# EAGLE design haasoscope_pro_preinput_board (EAGLE 9.6.2)
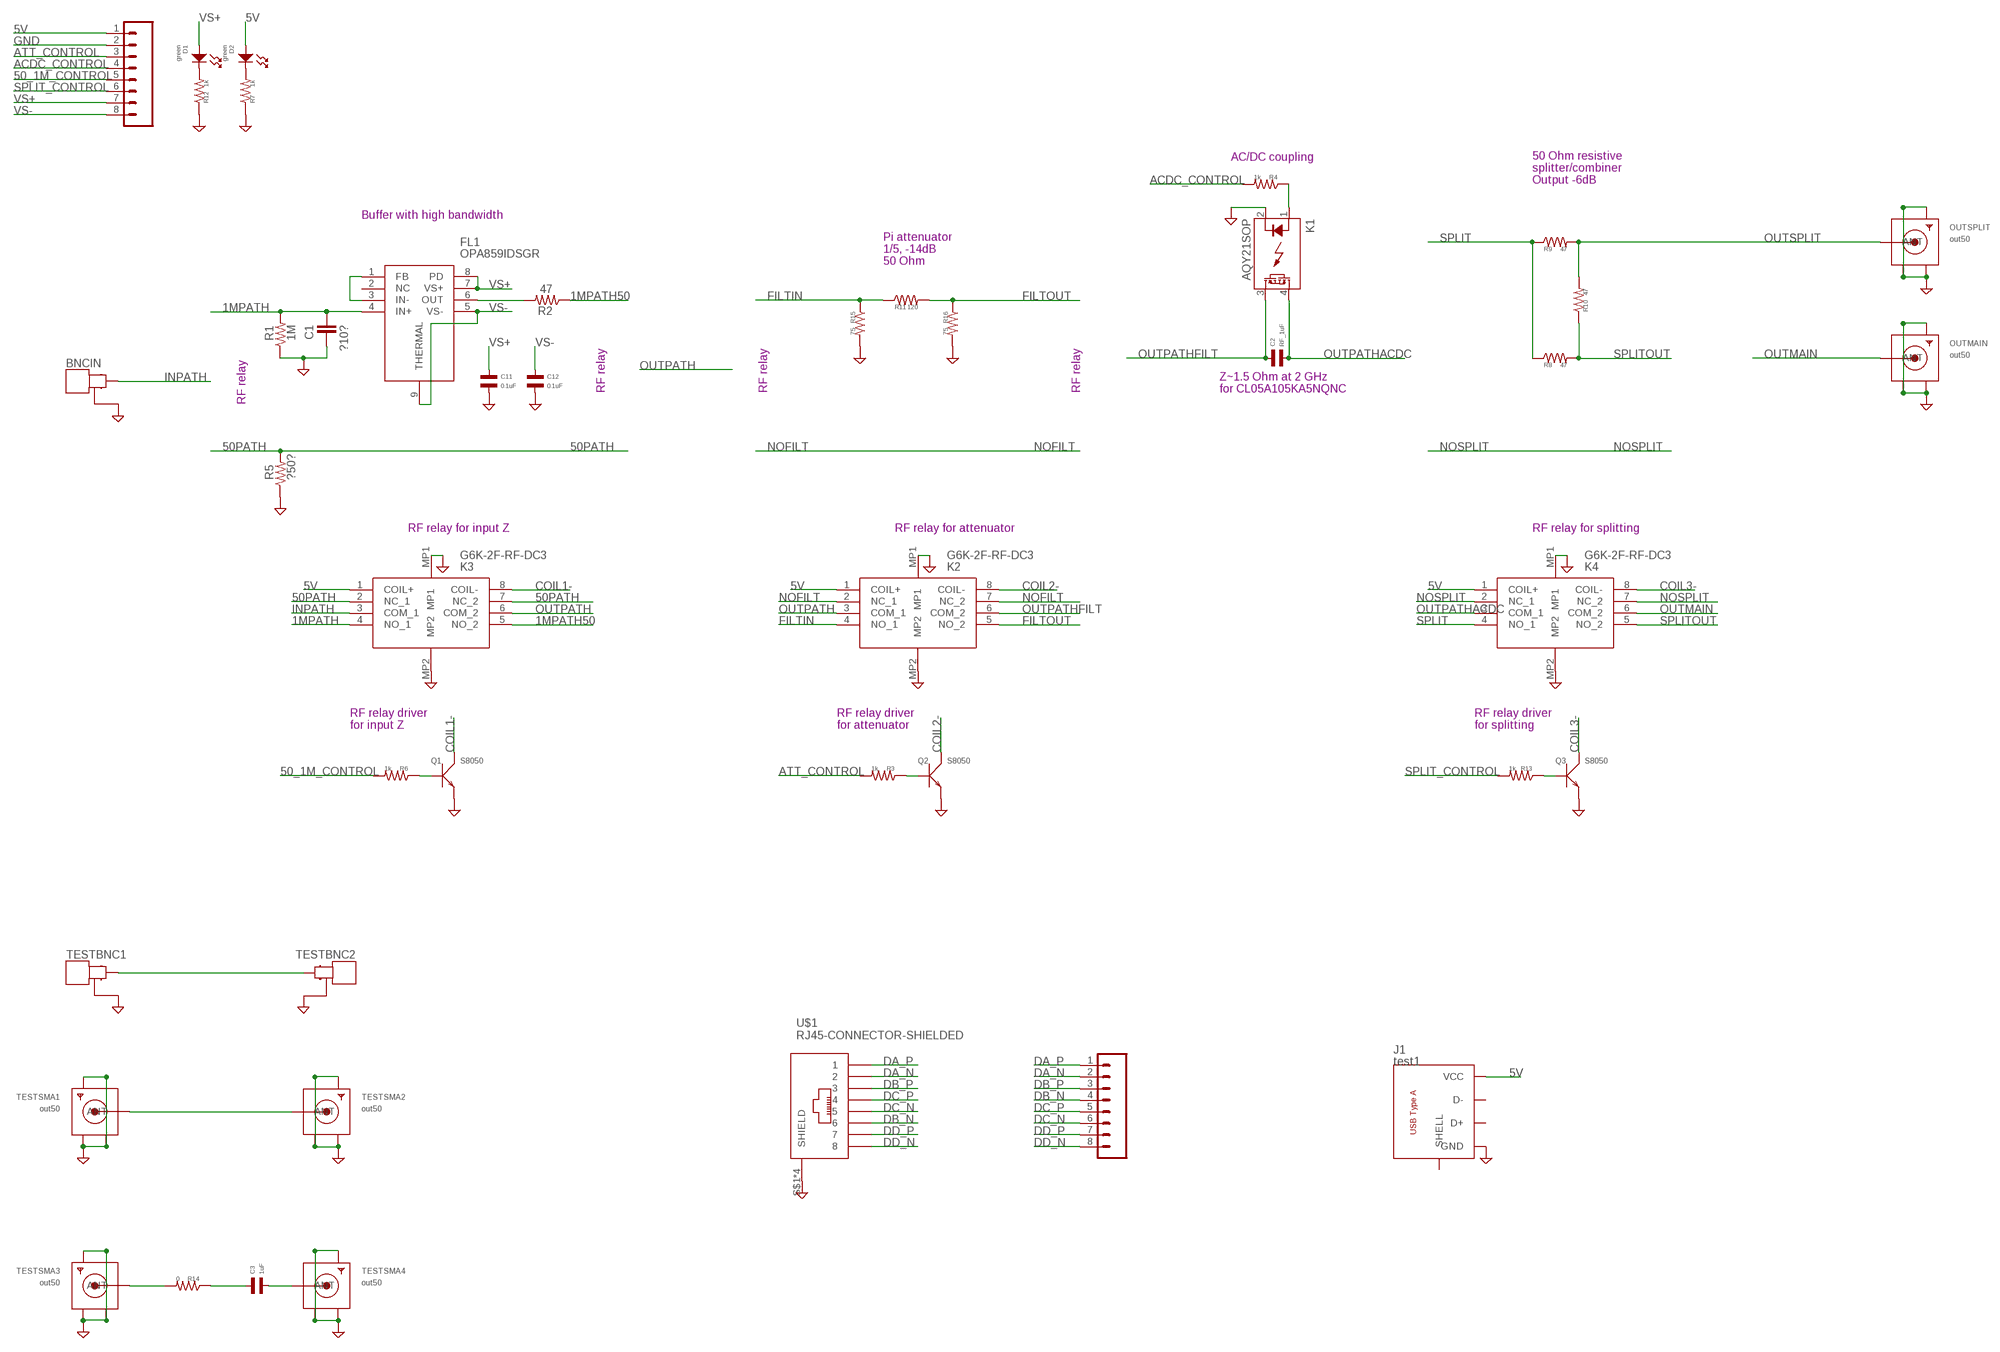
[diagram p0: schematic, sheet 1]

## Parts
BNCIN  MOLEX_BNC_73100-0105  [MOLEX-BNC-73100-0105]
C1  ?10?  C-EUC0805  [C0805]
C2  RF_1uF  CAPACITOR_NP_0402  [C0402]
C3  1uF  CAPACITOR_NP_0402  [C0402]
C11  0.1uF  CAPACITOR_NP_0402  [C0402]
C12  0.1uF  CAPACITOR_NP_0402  [C0402]
D1  green  LED_SINGLE-0603  [LED0603]
D2  green  LED_SINGLE-0603  [LED0603]
FL1  OPA859IDSGR  [SON50P200X200X80-9N]
J1  test1  USB-TYPE-ATHT-RA  [USB-2.0-A-THT-RA-TE_AMP-292303-1]
J2  8pin  CONN_08"  [1X08]
J4  8pin  CONN_08"  [1X08]
K1  AQY21SOP  [SOP04]
K2  G6K-2F-RF-DC3  [G6K2FRFDC3]
K3  G6K-2F-RF-DC3  [G6K2FRFDC3]
K4  G6K-2F-RF-DC3  [G6K2FRFDC3]
OUTMAIN  out50  SMACONNECTOR_EDGE  [SMA_EDGELAUNCH]
OUTSPLIT  out50  SMACONNECTOR_EDGE  [SMA_EDGELAUNCH]
Q1  S8050  SMD-TRANSISTORS-NPN-25V-500MW-S8050(SOT-23)  [SOT-23]
Q2  S8050  SMD-TRANSISTORS-NPN-25V-500MW-S8050(SOT-23)  [SOT-23]
Q3  S8050  SMD-TRANSISTORS-NPN-25V-500MW-S8050(SOT-23)  [SOT-23]
R1  1M  R-US_R0805  [R0805]
R2  47  R-US_R0805  [R0805]
R3  1k  RESISTOR_0402  [R0402]
R4  1k  RESISTOR_0402  [R0402]
R5  ?50?  R-US_R0805  [R0805]
R6  1k  RESISTOR_0402  [R0402]
R7  1k  RESISTOR_0402  [R0402]
R8  47  RESISTOR_0402  [R0402]
R9  47  RESISTOR_0402  [R0402]
R10  47  RESISTOR_0402  [R0402]
R11  120  RESISTOR_0402  [R0402]
R12  1k  RESISTOR_0402  [R0402]
R13  1k  RESISTOR_0402  [R0402]
R14  0  RESISTOR_0402  [R0402]
R15  75  RESISTOR_0402  [R0402]
R16  75  RESISTOR_0402  [R0402]
TESTBNC1  MOLEX_BNC_73100-0105  [MOLEX-BNC-73100-0105]
TESTBNC2  MOLEX_BNC_73100-0105  [MOLEX-BNC-73100-0105]
TESTSMA1  out50  SMACONNECTOR_EDGE  [SMA_EDGELAUNCH]
TESTSMA2  out50  SMACONNECTOR_EDGE  [SMA_EDGELAUNCH]
TESTSMA3  out50  SMACONNECTOR_EDGE  [SMA_EDGELAUNCH]
TESTSMA4  out50  SMACONNECTOR_EDGE  [SMA_EDGELAUNCH]
U$1  RJ45-CONNECTOR-SHIELDED  [RJ45_THT_RA_AMPH-FRJAE448]

## Nets
1MPATH: C1.2 FL1.4(IN+) K3.4(NO_1) R1.2
1MPATH50: K3.5(NO_2) R2.1
5V: D2.ANODE J1.P$1(VCC) J4.1 K2.1(COIL+) K3.1(COIL+) K4.1(COIL+)
50_1M_CONTROL: J4.5 R6.P$2
50PATH: K3.2(NC_1) K3.7(NC_2) R5.2
ACDC_CONTROL: J4.4 R4.P$2
ATT_CONTROL: J4.3 R3.P$2
COIL1-: K3.8(COIL-) Q1.3(C)
COIL2-: K2.8(COIL-) Q2.3(C)
COIL3-: K4.8(COIL-) Q3.3(C)
DA_N: J2.2 U$1.P$2
DA_P: J2.1 U$1.P$1
DB_N: J2.4 U$1.P$6
DB_P: J2.3 U$1.P$3
DC_N: J2.6 U$1.P$5
DC_P: J2.5 U$1.P$4
DD_N: J2.8 U$1.P$8
DD_P: J2.7 U$1.P$7
FILTIN: K2.4(NO_1) R11.P$1 R15.P$1
FILTOUT: K2.5(NO_2) R11.P$2 R16.P$1
GND: BNCIN.GND1(GND) BNCIN.GND2(GND) C1.1 C11.P$2 C12.P$2 J1.P$4(GND) J4.2 K1.2(K) K2.MP1 K2.MP2 K3.MP1 K3.MP2 K4.MP1 K4.MP2 OUTMAIN.GND@1(GND4) OUTMAIN.GND@2(GND3) OUTMAIN.GND@3(GND2) OUTMAIN.GND@4(GND1) OUTSPLIT.GND@1(GND4) OUTSPLIT.GND@2(GND3) OUTSPLIT.GND@3(GND2) OUTSPLIT.GND@4(GND1) Q1.2(E) Q2.2(E) Q3.2(E) R1.1 R5.1 R7.P$1 R12.P$1 R15.P$2 R16.P$2 TESTBNC1.GND1(GND) TESTBNC1.GND2(GND) TESTBNC2.GND1(GND) TESTBNC2.GND2(GND) TESTSMA1.GND@1(GND4) TESTSMA1.GND@2(GND3) TESTSMA1.GND@3(GND2) TESTSMA1.GND@4(GND1) TESTSMA2.GND@1(GND4) TESTSMA2.GND@2(GND3) TESTSMA2.GND@3(GND2) TESTSMA2.GND@4(GND1) TESTSMA3.GND@1(GND4) TESTSMA3.GND@2(GND3) TESTSMA3.GND@3(GND2) TESTSMA3.GND@4(GND1) TESTSMA4.GND@1(GND4) TESTSMA4.GND@2(GND3) TESTSMA4.GND@3(GND2) TESTSMA4.GND@4(GND1) U$1.S$1(SHIELD) U$1.S$2(SHIELD) U$1.S$3(SHIELD) U$1.S$4(SHIELD)
INPATH: BNCIN.SIGNAL K3.3(COM_1)
N$1: D1.CATHODE R12.P$2
N$2: Q2.1(B) R3.P$1
N$3: Q3.1(B) R13.P$1
N$4: FL1.6(OUT) R2.2
N$5: FL1.1(FB) FL1.3(IN-)
N$6: Q1.1(B) R6.P$1
N$7: D2.CATHODE R7.P$2
N$8: TESTBNC1.SIGNAL TESTBNC2.SIGNAL
N$9: TESTSMA1.P(ANT) TESTSMA2.P(ANT)
N$10: R14.P$2 TESTSMA3.P(ANT)
N$11: K1.1(A) R4.P$1
N$12: C3.P$1 R14.P$1
N$13: C3.P$2 TESTSMA4.P(ANT)
NOFILT: K2.2(NC_1) K2.7(NC_2)
NOSPLIT: K4.2(NC_1) K4.7(NC_2)
OUTMAIN: K4.6(COM_2) OUTMAIN.P(ANT)
OUTPATH: K2.3(COM_1) K3.6(COM_2)
OUTPATHACDC: C2.P$2 K1.4(DS1) K4.3(COM_1)
OUTPATHFILT: C2.P$1 K1.3(DS2) K2.6(COM_2)
OUTSPLIT: OUTSPLIT.P(ANT) R9.P$2 R10.P$2
SPLIT: K4.4(NO_1) R8.P$1 R9.P$1
SPLIT_CONTROL: J4.6 R13.P$2
SPLITOUT: K4.5(NO_2) R8.P$2 R10.P$1
VS+: C11.P$1 D1.ANODE FL1.7(VS+) FL1.8(PD) J4.7
VS-: C12.P$1 FL1.5(VS-) FL1.9(THERMAL) J4.8
Unconnected: FL1.2(NC) J1.P$2(D-) J1.P$3(D+) J1.S$1(SHELL) J1.S$2(SHELL)

## Notes on the sheet
- AC/DC coupling
- 50 Ohm resistive 
  splitter/combiner
  Output -6dB
- Buffer with high bandwidth
- Pi attenuator
  1/5, -14dB
  50 Ohm
- RF relay | RF relay | RF relay
- Z~1.5 Ohm at 2 GHz
  for CL05A105KA5NQNC
- RF relay
- RF relay for input Z | RF relay for attenuator | RF relay for splitting
- RF relay driver
  for input Z
- RF relay driver
  for attenuator
- RF relay driver
  for splitting

## Library data of the parts
BNCIN TESTBNC1 TESTBNC2 = connector:MOLEX_BNC_73100-0105: CONN BNC JACK R/A 50 OHM PCB; DIGIKEY: WM5524-ND; MPN: 73100-0105
C1 = resistor:C-EU: CAPACITOR, European symbol
C2 = MF_Passives:CAPACITOR_NP: Library: MF_Passives Description: Device for Non-Polarized Capacitors. Manufacture part number (MPN) can be added via Attributes. Check https://factory.macrofab.com/parts for the house parts list.; LCSC: C52923; POPULATE: 1
C3 C11 C12 = MF_Passives:CAPACITOR_NP: Library: MF_Passives Description: Device for Non-Polarized Capacitors. Manufacture part number (MPN) can be added via Attributes. Check https://factory.macrofab.com/parts for the house parts list.; POPULATE: 1
D1 D2 = MF_LEDs:LED_SINGLE: Library: MF_LEDs Description: Device for Single LED Packages. Manufacture part number (MFG#) can be added via Attributes.; HOUSEPART: NO; LCSC: C2286; POPULATE: 1
FL1 = OPA859IDSGR:OPA859IDSGR: 1.8 GHz Unity-Gain Bandwidth, 3.3 nV/Hz, FET Input Amplifier Source: Datasheet <http://www.ti.com/lit/gpn/opa859>; DESCRIPTION: 1.8 GHz Unity-Gain Bandwidth, 3.3 nV/Hz, FET Input Amplifier; HEIGHT: 0.8mm; MANUFACTURER_NAME: Texas Instruments; MANUFACTURER_PART_NUMBER: OPA859IDSGR; MOUSER_PART_NUMBER: 595-OPA859IDSGR; MOUSER_PRICE-STOCK: https://www.mouser.co.uk/ProductDetail/Texas-Instruments/OPA859IDSGR?qs=qSfuJ%252Bfl%2Fd54IFp3Wwx4ug%3D%3D
J1 = FlashPCB_Connectors:USB-TYPE-A
J2 J4 = SparkFun-Connectors:CONN_08: Multi connection point. Often used as Generic Header-pin footprint for 0.1 inch spaced/style header connections On any of the 0.1 inch spaced packages, you can populate with these: Break Away Headers - Straight <https://www.sparkfun.com/products/116> (PRT-00116) Break Away Male Headers - Right Angle <https://www.sparkfun.com/products/553> (PRT-00553) Female Headers <https://www.sparkfun.com/products/115> (PRT-00115) Break Away Headers - Machine Pin <https://www.sparkfun.com/products/117> (PRT-00117) Break Away Female Headers - Swiss Machine Pin <https://www.sparkfun.com/products/743> (PRT-00743) Arduino Stackable Header - 8 Pin <https://www.sparkfun.com/products/9279> (PRT-09279) For SCREWTERMINALS and SPRING TERMINALS visit here: Screw Terimnals on SparkFun.com <https://www.sparkfun.com/search/results?term=Screw+Terminals> (5mm/3.5mm/2.54mm spacing) This device is also useful as a general connection point to wire up your design to another part of your project. Our various solder wires solder well into these plated through hole pads. Hook-Up Wire - Assortment (Stranded, 22 AWG) <https://www.sparkfun.com/products/11375> (PRT-11375) Hook-Up Wire - Assortment (Solid Core, 22 AWG) <https://www.sparkfun.com/products/11367> (PRT-11367) View the entire wire category on our website here <https://www.sparkfun.com/categories/141> Special notes: Molex polarized connector foot print use with SKU : PRT-08231 with associated crimp pins and housings. 1MM SMD Version SKU: PRT-10208 NOTES ON THE VARIANTS LOCK and LOCK_LONGPADS... This footprint was designed to help hold the alignment of a through-hole component (i.e. 6-pin header) while soldering it into place. You may notice that each hole has been shifted either up or down by 0.005 of an inch from it's more standard position (which is a perfectly straight line). This slight alteration caused the pins (the squares in the middle) to touch the edges of the holes. Because they are alternating, it causes a "brace" to hold the component in place. 0.005 has proven to be the perfect amount of "off-center" position when using our standard breakaway headers. Although looks a little odd when you look at the bare footprint, once you have a header in there, the alteration is very hard to notice. Also,if you push a header all the way into place, it is covered up entirely on the bottom side.; PROD_ID: CONN-08438
K1 = relay:AQY*: PhotoMOS Relay NAiS Source: http://www.panasonic-electric-works.com/catalogues/downloads/photomos/ds_x615_en_aqz10_20.pdf; LCSC: C7435105; MPN: AQY210S; OC_FARNELL: unknown; OC_NEWARK: unknown
K2-K4 = G6K-2F-RF-DC3:G6K-2F-RF-DC3: High Frequency / RF Relays 1GHz Std Grd NoLatch DPDT 3VDC 100mW Source: Datasheet <https://componentsearchengine.com/Datasheets/1/G6K-2F-RF-DC3.pdf>; DESCRIPTION: High Frequency / RF Relays 1GHz Std Grd NoLatch DPDT 3VDC 100mW; HEIGHT: 5.7mm; LCSC: C397195; MANUFACTURER_NAME: Omron Electronics; MANUFACTURER_PART_NUMBER: G6K-2F-RF-DC3; MOUSER_PART_NUMBER: 653-G6K-2F-RF-DC3; MOUSER_PRICE-STOCK: https://www.mouser.co.uk/ProductDetail/Omron-Electronics/G6K-2F-RF-DC3?qs=Pjd0UV7BHP8BL6Nr%252BzW3GA%3D%3D
OUTMAIN OUTSPLIT TESTSMA1-TESTSMA4 = adafruit:SMACONNECTOR: SMA Connector 90° DIP SMA Connector, 50 Ohm (4UConnector: 07259)
Q1-Q3 = Seeed-Transistor:SMD-TRANSISTORS-NPN-25V-500MW-S8050(SOT-23): 305010017; LCSC: C7420370; MPN: S8050
R1 R2 R5 = resistor:R-US_: RESISTOR, American symbol
R3 R4 R6-R16 = MF_Passives:RESISTOR: Library: MF_Passives Description: Device for Resistors. Manufacture part number (MPN), Voltage, Tolerance, and Wattage Rating can be added via Attributes. Check https://factory.macrofab.com/parts for the house parts list.; POPULATE: 1
U$1 = FlashPCB_Connectors:RJ45-CONNECTOR-SHIELDED

## Net classes
0 default: width 0.203 mm
1 power: width 0.152 mm

## Board
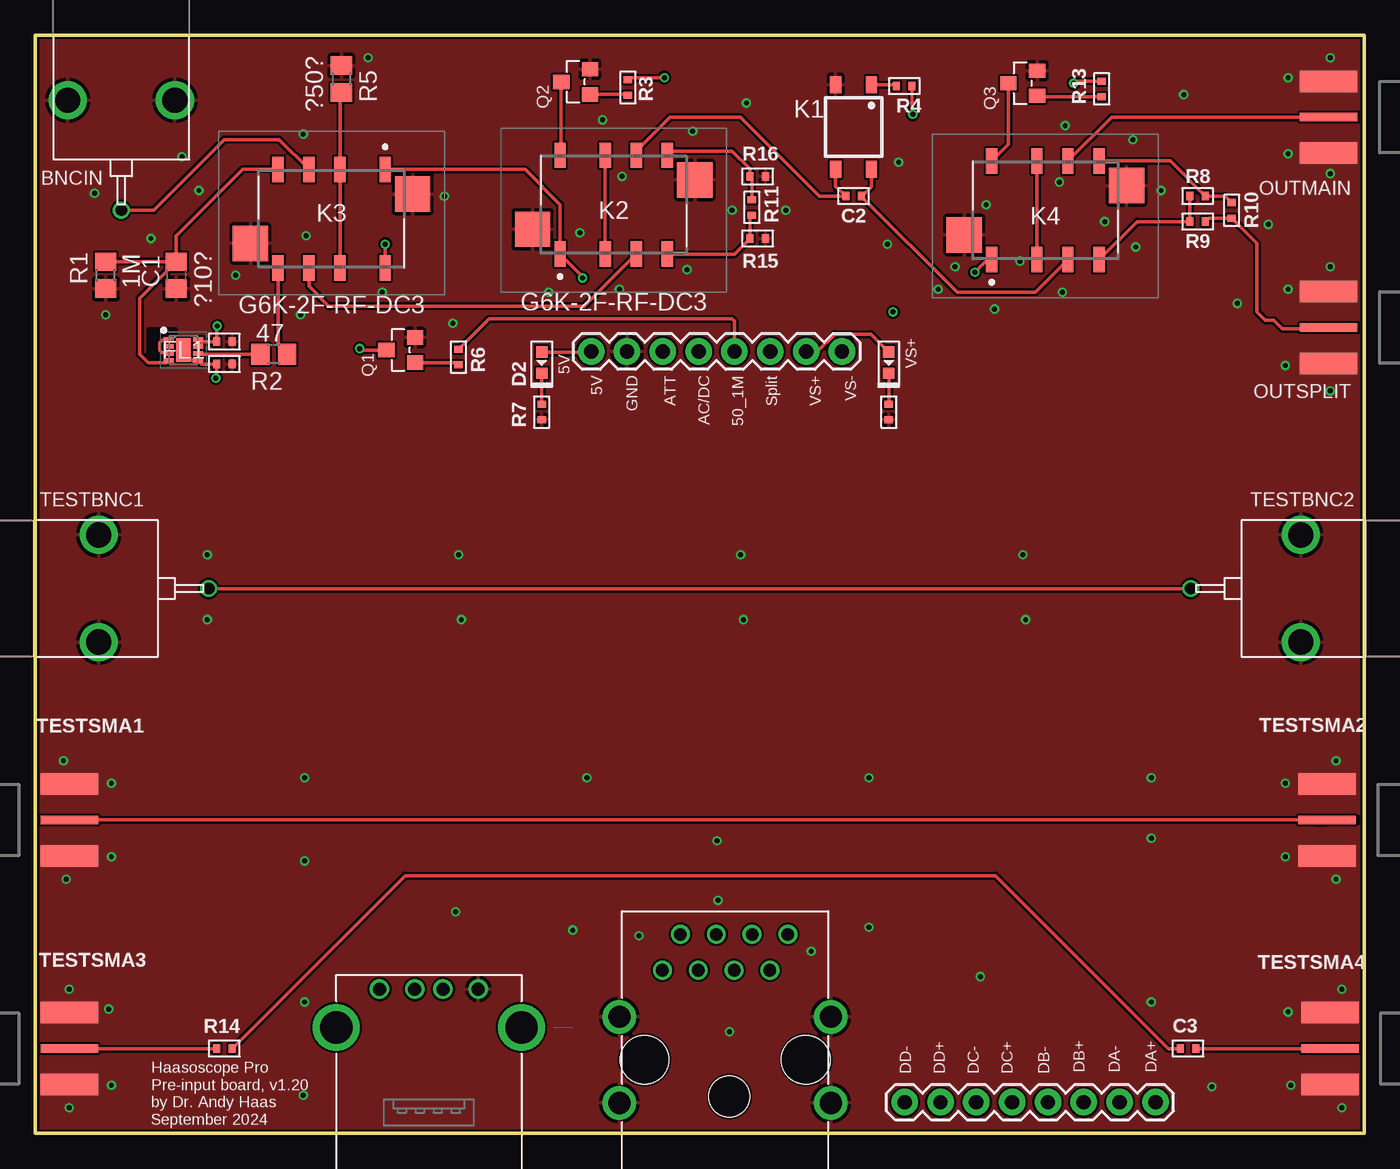
[diagram p1: board, top side]
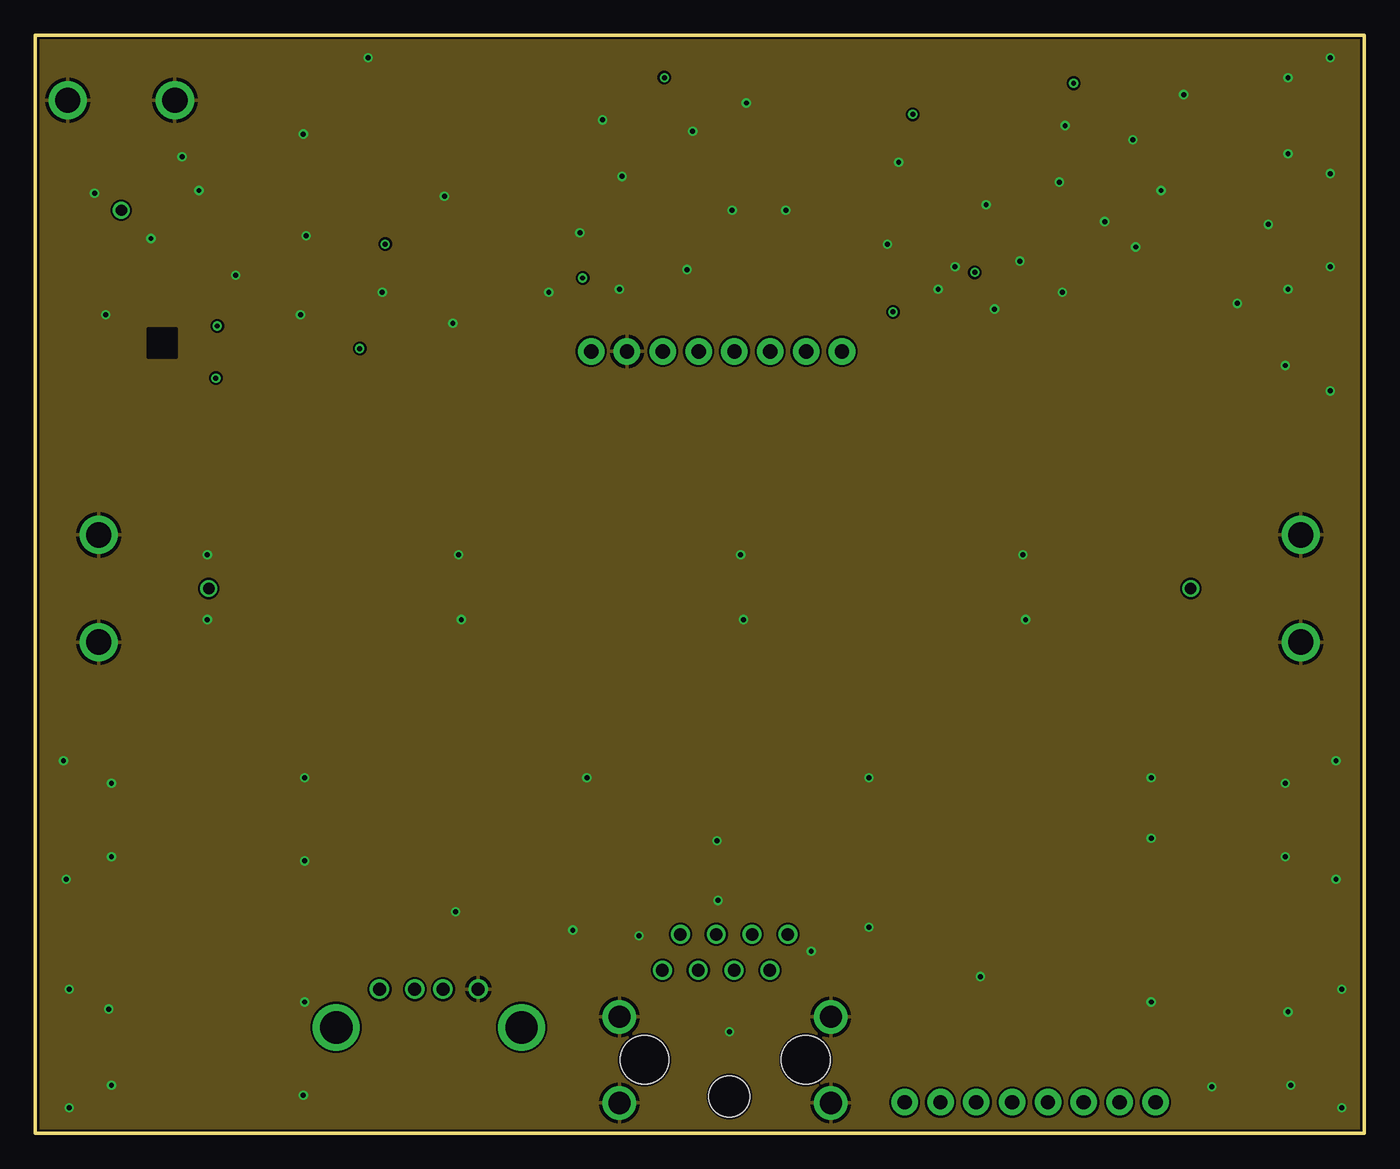
[diagram p2: board, inner layer topgnd]
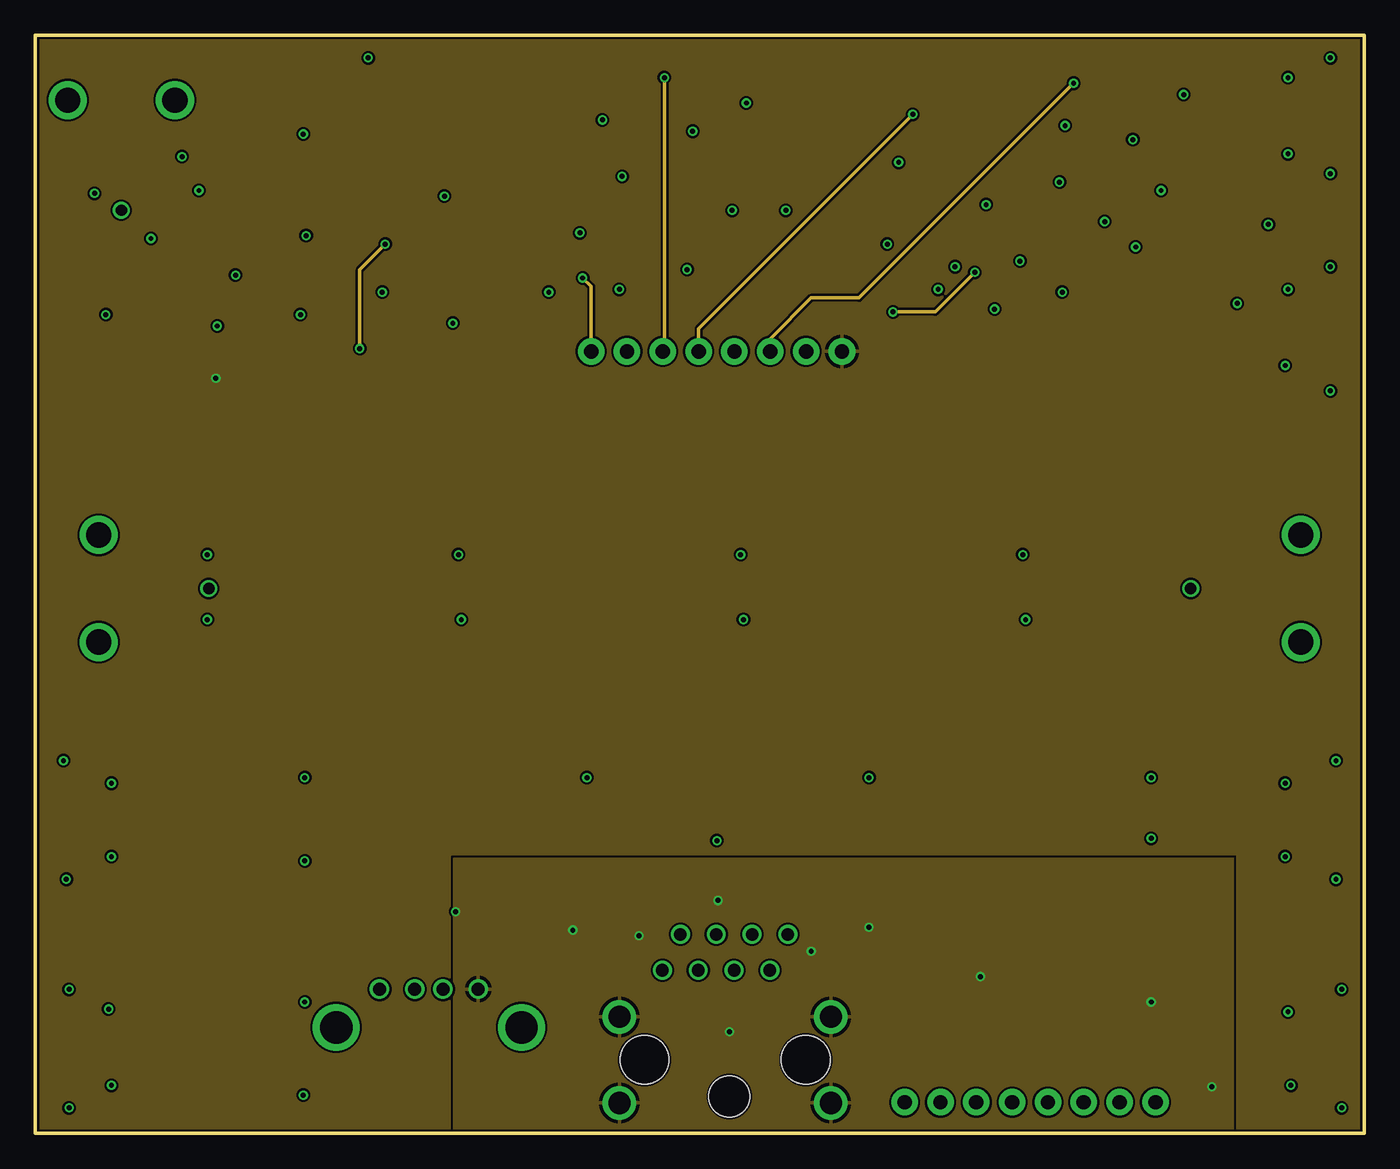
[diagram p3: board, inner layer vsmin]
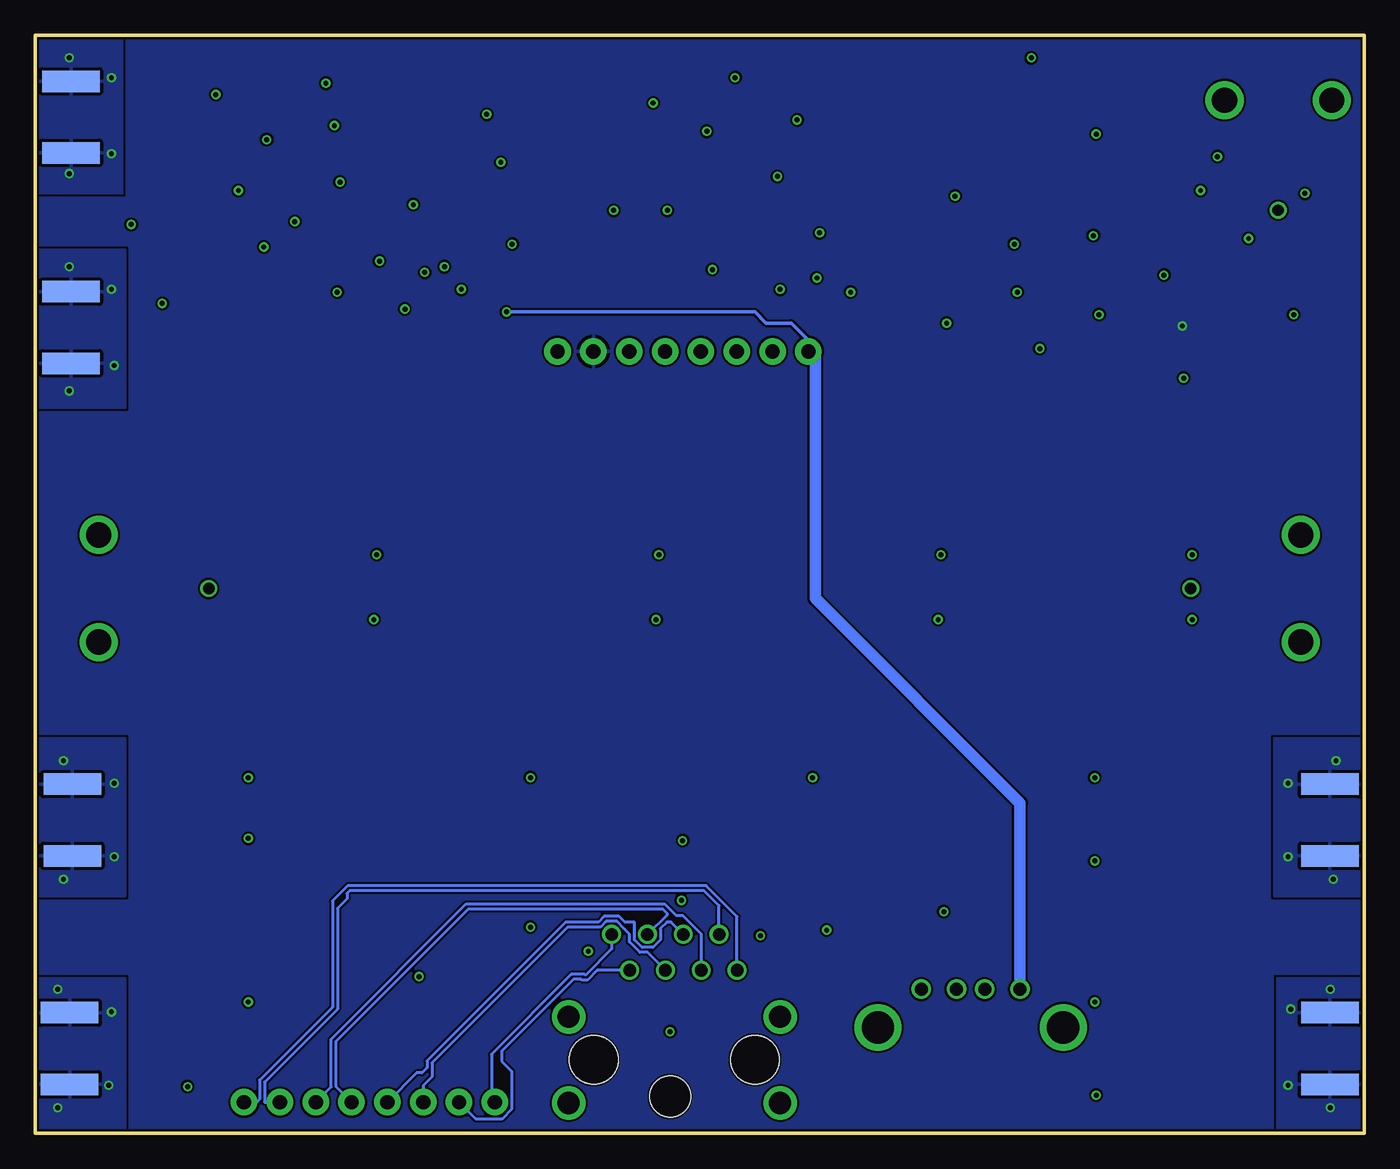
[diagram p4: board, bottom side, seen from below]

Size 94.2 x 77.8 mm. Coordinates in mm from the lower left corner, seen from the top.
Outline: 0,77.8 0,0 94.2,0 94.2,77.8 0,77.8
Copper layers (1*2*15*16): top 0.035mm / dielectric 0.2mm / topgnd 0.0175mm / dielectric 0.3mm / vsmin 0.0175mm / dielectric 0.2mm / vsplus 0.035mm
Design rules "Seeed_AllPCB_MacroFab_haas6mil *": minimum track width 6mil, minimum drill 12mil, track to track 6mil, track to pad 6mil, pad to pad 6mil, via to via 6mil, smd to smd 0mil, copper to edge 6mil, drill to drill 6mil, minimum pad ring 6mil, minimum via ring 6mil, stop-mask expansion 6mil, vias tented up to drill 25mil, thermal gap 10mil
Holes 2.9 mm at 49.2,2.6

### Footprints (pad centres in the part's own frame; a part is rotated, then mirrored left to right if it is on the bottom)
MOLEX-BNC-73100-0105 = drill 1.8: GND1 -3.8,-3.9; GND2 3.8,-3.9 | drill 0.8: SIGNAL 0,3.9
C0805 = smd 1.3 x 1.5: 1 -0.95,0; 2 0.95,0
C0402 = smd 0.5 x 0.6: P$1 -0.55,0; P$2 0.55,0
LED0603 = smd 0.8 x 0.8: ANODE 0.75,0; CATHODE -0.75,0
SON50P200X200X80-9N = smd 0.7 x 0.3: 1 -1.05,0.75; 2 -1.05,0.25; 3 -1.05,-0.25; 4 -1.05,-0.75; 5 1.05,-0.75; 6 1.05,-0.25; 7 1.05,0.25; 8 1.05,0.75 | smd 1 x 1.7: 9 0,0
USB-2.0-A-THT-RA-TE_AMP-292303-1 = drill 0.92: P$1 -3.5,2.71; P$2 -1,2.71; P$3 1,2.71; P$4 3.5,2.71 | drill 2.3: S$1 -6.57,0; S$2 6.57,0
1X08 = drill 1.016 pad 1.88: 1 0,0; 2 2.54,0; 3 5.08,0; 4 7.62,0; 5 10.16,0; 6 12.7,0; 7 15.24,0; 8 17.78,0
SOP04 = smd 0.8 x 1.2: 1 -1.27,-3; 2 1.27,-3; 3 1.27,3; 4 -1.27,3
G6K2FRFDC3 = smd 0.8 x 1.8: 1 -3.8,-3.5; 2 -0.6,-3.5; 3 1.6,-3.5; 4 3.8,-3.5; 5 3.8,3.5; 6 1.6,3.5; 7 -0.6,3.5; 8 -3.8,3.5 | smd 2.5 x 2.5: MP1 -5.75,-1.75; MP2 5.75,1.75
SMA_EDGELAUNCH = smd 4.064 x 1.524: GND@1 2.032,-2.54; GND@2 2.032,2.54 | smd 4.064 x 1.524 bottom: GND@3 2.032,2.54; GND@4 2.032,-2.54 | smd 4.064 x 0.6: P 2.032,0
SOT-23 = smd 1.016 x 1.143: 1 -0.889,-1.016; 2 0.889,-1.016; 3 0,1.016
R0805 = smd 1.3 x 1.5: 1 -0.95,0; 2 0.95,0
R0402 = smd 0.5 x 0.6: P$1 -0.55,0; P$2 0.55,0
RJ45_THT_RA_AMPH-FRJAE448 = drill 0.89: P$1 -4.445,6.35; P$2 -3.175,8.89; P$3 -1.905,6.35; P$4 -0.635,8.89; P$5 0.635,6.35; P$6 1.905,8.89; P$7 3.175,6.35; P$8 4.445,8.89 | drill 1.575: S$1 -7.493,-3.048; S$2 7.493,-3.048; S$3 7.493,3.048; S$4 -7.493,3.048 | hole 3.454: -5.715,0; 5.715,0

### Placement (x,y rotation side)
BNCIN  6.1,69.3 180 top
C1  10,60.8 90 top
C2  1uF  [C0402]  58,66.4 0 top
C3  81.7,6 0 top
C11  13.4,56.1 0 top
C12  13.4,54.5 0 top
D1  60.5,54.6 90 top
D2  35.9,54.6 90 top
FL1  10.5,55.5 0 top
J1  27.9,7.5 0 top
J2  79.4,2.2 180 top
J4  39.4,55.4 0 top
K1  58,71.3 180 top
K2  41,65.8 0 top
K3  21,64.8 180 top
K4  71.6,65.4 0 top
OUTMAIN  93.7,72 180 top
OUTSPLIT  93.7,57.1 180 top
Q1  25.9,55.5 90 top
Q2  38.3,74.5 90 top
Q3  70,74.4 90 top
R1  5,60.8 90 top
R2  16.9,55.2 180 top
R3  42,74.1 90 top
R4  61.6,74.2 0 top
R5  21.7,74.7 270 top
R6  30,55 90 top
R7  35.9,51.1 90 top
R8  82.4,66.4 0 top
R9  82.4,64.6 0 top
R10  84.8,65.4 270 top
R11  50.8,65.6 90 top
R12  60.5,51.1 90 top
R13  75.6,74 90 top
R14  13.4,6 180 top
R15  51.2,63.4 0 top
R16  51.2,67.8 0 top
TESTBNC1  8.4,38.6 270 top
TESTBNC2  85.8,38.6 90 top
TESTSMA1  0.4,22.2 0 top
TESTSMA2  93.6,22.2 180 top
TESTSMA3  0.4,6 0 top
TESTSMA4  93.8,6 180 top
U$1  48.9,5.2 0 top

### Tracks (layer width: path | path; a pad name or v marks a point on that pad's centre or on a via)
1MPATH
  top 0.254: K3.4 14.7,68.3 10,63.6 C1.2 | C1.2 R1.2 | C1.2 7.4,59.15 7.4,55.2 8,54.6 9.3,54.6 FL1.4
1MPATH50
  top 0.254: K3.5 17.2,55.85 R2.1
5V  (via drill 0.35)
  top 0.254: K3.1 34.7,68.3 37.2,65.8 K2.1 38.8,60.7 v38.8,60.6 | D2.ANODE 39.35,55.35 J4.1 | K4.1 67.5,61.9 v66.6,61
  vsmin 0.254: v38.8,60.6 39.4,60 J4.1 | v66.6,61 63.8,58.2 v60.8,58.2
  vsplus 0.254: v60.8,58.2 43.2,58.2 42.4,57.4 40.6,57.4 39.4,56.2 39.4,55.5 J4.1
  vsplus 0.813: J1.P$1 24.4,23.4 38.9,37.9 38.9,55 39.4,55.5
50_1M_CONTROL
  top 0.254: R6.P$2 32.15,57.7 49.4,57.7 49.56,57.54 J4.5
50PATH
  top 0.254: R5.2 21.6,73.65 K3.2 K3.7
ACDC_CONTROL  (via drill 0.35)
  top 0.254: R4.P$2 62.15,72.25 v62.2,72.2
  vsmin 0.254: v62.2,72.2 47.02,57.02 J4.4
ATT_CONTROL  (via drill 0.35)
  top 0.254: R3.P$2 42.15,74.8 v44.6,74.8
  vsmin 0.254: v44.6,74.8 44.6,55.52 J4.3
COIL1-  (via drill 0.35)
  top 0.254: Q1.3 23.1,55.5 v23,55.6 | v24.8,63 K3.8
  vsmin 0.254: v23,55.6 23,61.2 v24.8,63
COIL2-
  top 0.254: Q2.3 37.28,69.38 K2.8
COIL3-
  top 0.254: Q3.3 68.98,70.08 K4.8
DA_N
  vsplus 0.203: U$1.P$2 45.72,16.12 46.8,17.2 71.9,17.2 72.1,17 72.1,16.62 72.78,15.93 72.78,8.8 77.95,3.62 77.95,2.23 77.93,2.2 J2.2
DA_P
  vsplus 0.203: U$1.P$1 44.45,15.36 46.65,17.56 72.05,17.56 73.14,16.46 73.14,8.94 78.31,3.77 78.31,2.39 78.5,2.2 J2.1
DB_N
  vsplus 0.203: J2.4 72.87,3.29 72.87,6.53 63.5,15.9 49.73,15.9 49.43,15.6 49.43,15.46 U$1.P$6
DB_P
  vsplus 0.203: J2.3 73.23,3.29 73.23,6.68 63.65,16.26 49.59,16.26 48.77,15.44 48.31,15.44 47,14.12 U$1.P$3
DC_N
  vsplus 0.203: U$1.P$5 50.8,12.81 51.33,12.81 52.08,13.56 52.08,14.1 52.42,14.44 52.42,14.47 52.96,15.01 53.73,15.01 54.14,14.6 56.46,14.6 66.08,4.99 66.08,3.99 66.7,3.37 J2.6
DC_P
  vsplus 0.203: U$1.P$4 49.13,14.96 49.44,14.96 49.9,14.49 49.88,14.47 49.88,13.71 50.42,13.17 51.19,13.17 51.73,13.71 51.73,14.96 52.41,14.96 52.82,15.37 53.87,15.37 54.29,14.96 56.61,14.96 66.43,5.13 66.43,4.64 66.8,4.28 67.16,4.28 J2.5
DD_N
  vsplus 0.203: U$1.P$8 53.34,13.07 55.21,11.21 55.26,11.26 56.21,11.26 61.87,5.6 61.87,2.45 J2.8
DD_P
  vsplus 0.203: U$1.P$7 54.36,11.55 55.06,10.85 55.44,10.85 55.49,10.9 56.06,10.9 61.14,5.82 61.14,5.11 60.43,4.39 60.43,1.71 61.13,1.01 62.97,1.01 J2.7
FILTIN
  top 0.254: K2.4 49.55,62.3 R15.P$1 50.65,64.9 R11.P$1
FILTOUT
  top 0.254: R11.P$2 50.8,67.65 R16.P$1 50.65,68.35 49.4,69.6 45.1,69.6 K2.5
GND  (via drill 0.35)
  other vias: 5,58 88.8,59.8 91.8,61.4 88.6,54.4 91.8,52.6 88.8,69.4 91.8,68 88.8,74.8 91.8,76.2 92.2,26.4 88.6,24.8 88.6,19.6 92.2,18 92.6,10.2 88.8,8.6 89,3.4 92.6,1.8 2.4,10.2 5.2,8.8 5.4,3.4 2.4,1.8 2.2,18 2,26.4 5.4,24.8 5.4,19.6 23.6,76.2 4.2,66.6 8.2,63.4 11.6,66.8 10.4,69.2 19,70.8 19.2,63.6 18.8,58 24.6,59.6 29.6,57.4 36.4,59.6 41.4,59.8 38.6,63.8 41.6,67.8 40.2,71.8 46.6,71 46.2,61.2 53.2,65.4 49.4,65.4 50.4,73 61.2,68.8 60.4,63 64,59.8 65.2,61.4 29,66.4 14.2,60.8 67.4,65.8 68,58.4 72.8,59.6 69.8,61.8 72.6,67.4 75.8,64.6 78,62.8 79.8,66.8 77.8,70.4 87.4,64.4 85.2,58.8 81.4,73.6 73,71.4 12.2,36.4 12.2,41 30,41 30.2,36.4 50,41 50.2,36.4 70.2,36.4 70,41 19.1,25.2 19.1,19.3 39.1,25.2 38.1,14.4 59.1,25.2 59.1,14.6 79.1,25.2 79.1,20.9 19.1,9.3 48.4,16.5 79.1,9.3 83.4,3.3 67,11.1 29.8,15.7 19,2.7 48.32,20.73 42.8,14 55,12.9 49.2,7.2
  pour topgnd: 97.2,82.3 97.2,82.3 97.2,-3.2 -4,-3.2 -4,82.3
  pour top: -2,-1.7 -2,79.3 -1.5,79.8 95.2,79.8 95.7,79.3 95.7,-1.7
  cutout topgnd: 8,57 10,57 10,55 8,55
  cutout top: 8,57 10,57 10,55 8,55
  pour vsplus: 94.4,77.8 94.4,66.6 88,66.6 88,77.8
  pour vsplus: 94.2,62.6 94.2,51.4 87.8,51.4 87.8,62.6
  pour vsplus: 94.2,28 94.2,16.8 87.8,16.8 87.8,28
  pour vsplus: 6.4,28 6.4,16.8 0,16.8 0,28
  pour vsplus: 94.2,11 94.2,-0.2 87.8,-0.2 87.8,11
  pour vsplus: 6.2,11 6.2,-0.2 -0.2,-0.2 -0.2,11
  pour vsmin: 84.9,19.5 84.9,-0.6 29.7,-0.6 29.7,19.5
INPATH
  top 0.254: K3.3 17.3,70.4 13.4,70.4 8.4,65.4 BNCIN.SIGNAL
N$1
  top 0.254: D1.CATHODE R12.P$2
N$2
  top 0.254: Q2.1 41.94,73.61 R3.P$1
N$3
  top 0.254: Q3.1 71.08,73.45 R13.P$1
N$4
  top 0.254: FL1.6 11.6,55.2 R2.2
N$5
  top 0.254: FL1.1 9.38,56.18 8.98,56.18 8.82,56.02 8.82,55.48 8.98,55.32 9.38,55.32 FL1.3
N$6
  top 0.254: Q1.1 29.84,54.61 R6.P$1
N$7
  top 0.254: D2.CATHODE R7.P$2
N$8
  top 0.254: TESTBNC1.SIGNAL TESTBNC2.SIGNAL
N$9
  top 0.254: TESTSMA1.P 90.6,22.2 90.8,22 91.37,22 TESTSMA2.P
N$10
  top 0.254: TESTSMA3.P R14.P$2
N$11
  top 0.254: K1.1 60.95,74.3 R4.P$1
N$12
  top 0.254: R14.P$1 26.2,18.25 68.05,18.25 80.3,6 C3.P$1
N$13
  top 0.254: C3.P$2 TESTSMA4.P
NOFILT
  top 0.254: K2.7 K2.2
NOSPLIT
  top 0.254: K4.7 K4.2
OUTMAIN
  top 0.254: K4.6 76.3,72 OUTMAIN.P
OUTPATH
  top 0.254: K2.3 38.9,58.6 20.8,58.6 19.4,60 K3.6
OUTPATHACDC
  top 0.254: K4.3 70.9,59.6 65.35,59.6 58.58,66.38 | 58.58,66.38 C2.P$2 | K1.4 59.27,67.07 58.58,66.38
OUTPATHFILT
  top 0.254: K1.3 56.73,67.12 C2.P$1 55.6,66.4 50,72 45,72 42.6,69.6 K2.6
OUTSPLIT
  top 0.254: R9.P$2 83.2,64.85 R10.P$2 86.6,63.05 86.6,58.2 87.2,57.6 87.8,57.6 88.4,57 91.57,57 OUTSPLIT.P
SPLIT
  top 0.254: R8.P$1 R9.P$1 78.1,64.6 K4.4
SPLIT_CONTROL  (via drill 0.35)
  top 0.254: R13.P$2 73.75,74.55 v73.6,74.4
  vsmin 0.254: v73.6,74.4 58.4,59.2 55,59.2 52.1,56.3 J4.6
SPLITOUT
  top 0.254: K4.5 80.45,68.9 R8.P$2 84.35,66.4 R10.P$1
VS+  (via drill 0.35)
  top 0.254: J4.7 55.46,55.4 56.67,56.62 59.23,56.62 D1.ANODE | C11.P$1 12.85,56.95 12.9,57 v12.9,57.2 | C11.P$1 11.7,56.1 FL1.8 FL1.7 11.9,56.1 C11.P$1
  pour vsplus (rank 2): -1,78.8 95.2,79.2 95.2,79.2 95.2,-2.4 -1,-2.4
VS-  (via drill 0.35)
  top 0.254: v12.8,53.5 12.85,53.55 C12.P$1 11.8,54.5 FL1.5 11.15,54.75 10.92,54.98 10.92,55.08 FL1.9
  pour vsmin (rank 2): -3,81.3 96.2,81.7 96.2,81.7 96.2,-1 -3,-1

### Text on the board
tPlace: 5V | 5V | GND | ATT | AC/DC | 50_1M | Split | VS+ | VS- | VS+ | DD- | DD+ | DC- | DC+ | DB- | DB+ | DA- | DA+ | Haasoscope Pro / Pre-input board, v1.20 / by Dr. Andy Haas / September 2024